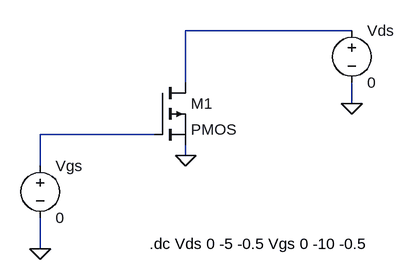
[diagram p0: schematic PMOS.asc]
PMOS.asc, the LTspice schematic file:
Version 4
SHEET 1 880 680
WIRE 432 32 176 32
WIRE 176 112 176 32
WIRE 432 144 432 112
WIRE 128 192 -48 192
WIRE 176 224 176 208
WIRE -48 240 -48 192
WIRE -48 368 -48 320
FLAG 176 224 0
FLAG -48 368 0
FLAG 432 144 0
SYMBOL pmos 128 112 R0
SYMATTR InstName M1
SYMBOL voltage 432 16 R0
WINDOW 123 0 0 Left 0
WINDOW 39 0 0 Left 0
SYMATTR InstName Vds
SYMATTR Value 0
SYMBOL voltage -48 224 R0
WINDOW 123 0 0 Left 0
WINDOW 39 0 0 Left 0
SYMATTR InstName Vgs
SYMATTR Value 0
TEXT 120 360 Left 2 !.dc Vds 0 -5 -0.5 Vgs 0 -10 -0.5

The netlist it stands for:
* PMOS.asc
M1 N001 N002 0 0 PMOS
Vds N001 0 0
Vgs N002 0 0
.model NMOS NMOS
.model PMOS PMOS
.lib standard.mos
.dc Vds 0 -5 -0.5 Vgs 0 -10 -0.5
.backanno
.end